# EAGLE design attiny-breakout (EAGLE 9.6.2)
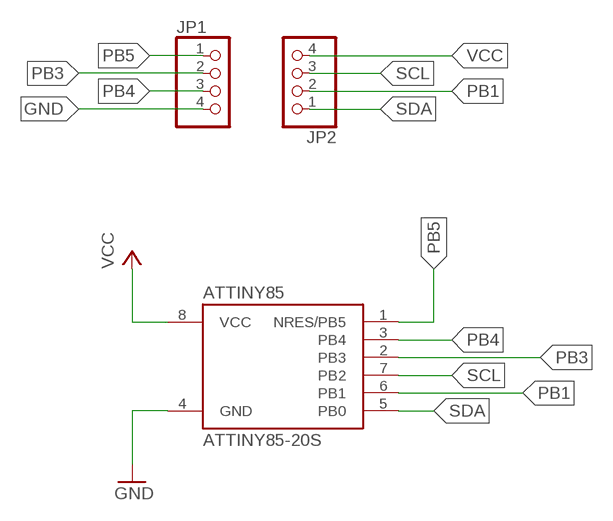
[diagram p0: schematic, sheet 1]

## Parts
ATTINY85  ATTINY85-20S  [SOIC8_EIAJ_208MIL]
JP1  PINHD-1X4  [1X04]
JP2  PINHD-1X4  [1X04]

## Nets
GND: ATTINY85.4(GND) JP1.4
PB1: ATTINY85.6(PB1) JP2.2
PB3: ATTINY85.2(PB3) JP1.2
PB4: ATTINY85.3(PB4) JP1.3
PB5: ATTINY85.1(NRES/PB5) JP1.1
SCL: ATTINY85.7(PB2) JP2.3
SDA: ATTINY85.5(PB0) JP2.1
VCC: ATTINY85.8(VCC) JP2.4

## Library data of the parts
ATTINY85 = _hhn_attiny25_45_85:ATTINY85*: ATMEL ATtiny 85 Packages: P = PDIP 08 30mil S = SOIC 08 EIAJ 208mil Technologies Note: for complete ordering code (temp. range, finish, tape&reel etc.) see www.atmel.com • Supply Voltage: V = (1.8…5.5)V | [blank] = (2.7…5.5)V • Speed: 10 = 10 MHz | 20 = 20 MHz Author: Dipl.-Ing. FH Rainer Bayer HHN Hochschule Heilbronn (Heilbronn University), rainer.bayer@hs-heilbronn.de Ingenieurbüro ing-rb, mail@ing-rb.de
JP1 JP2 = pinhead:PINHD-1X4: PIN HEADER

## Board
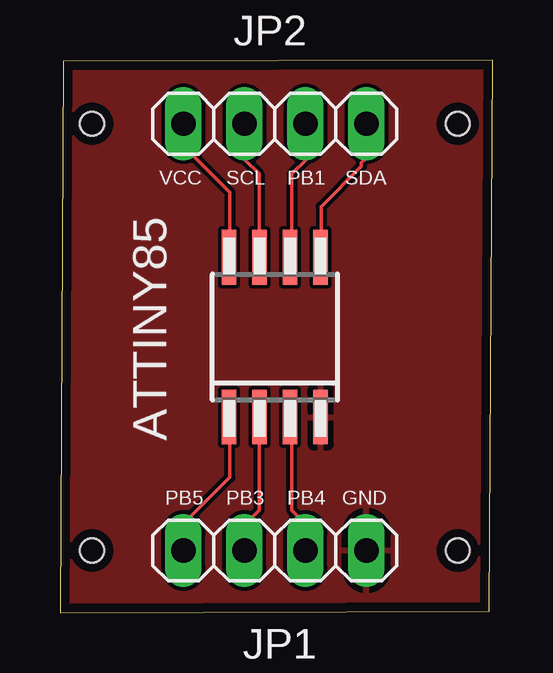
[diagram p1: board, top side]

Size 18.02 x 23.04 mm. Coordinates in mm from the lower left corner, seen from the top.
Outline: 0,0 17.89,0.06 18.02,23.04 0.13,22.98 0,0
Copper layers (1*16): Top 0.035559375mm / dielectric 1.6mm / Bottom 0.035559375mm
Design rules "oshpark-2layer": minimum track width 6mil, minimum drill 10mil, track to track 6mil, track to pad 6mil, pad to pad 6mil, via to via 6mil, smd to smd 6mil, copper to edge 15mil, drill to drill 6mil, minimum pad ring 5mil, minimum via ring 5mil, stop-mask expansion 2.5mil, vias tented up to drill 0mil, thermal gap 10mil
Holes 1 mm at 1.33,20.38 16.57,20.38 1.33,2.6 16.57,2.6

### Footprints (pad centres in the part's own frame; a part is rotated, then mirrored left to right if it is on the bottom)
SOIC8_EIAJ_208MIL = smd 0.6 x 2.286: 1 -1.905,-3.33; 2 -0.635,-3.33; 3 0.635,-3.33; 4 1.905,-3.33; 5 1.905,3.33; 6 0.635,3.33; 7 -0.635,3.33; 8 -1.905,3.33
1X04 = drill 1.016 long: 1 -3.81,0; 2 -1.27,0; 3 1.27,0; 4 3.81,0

### Placement (x,y rotation side)
ATTINY85  8.95,11.49 0 top
JP1  8.95,2.6 0 top
JP2  8.95,20.38 180 top

### Tracks (layer width: path | path; a pad name or v marks a point on that pad's centre or on a via)
GND
  pour Top: -1.21,24.19 -1.21,-1.21 19.11,-1.21 19.11,24.19
PB1
  Top 0.152: ATTINY85.6 9.66,14.94 9.66,18.3 10.27,18.91 10.27,20.28 JP2.2
PB3
  Top 0.152: JP1.2 7.68,3.67 8.29,4.27 8.29,8.08 ATTINY85.2
PB4
  Top 0.152: ATTINY85.3 9.66,8.08 9.66,4.27 10.12,3.82 10.12,2.6 JP1.3
PB5
  Top 0.152: ATTINY85.1 7.07,8.08 7.07,5.65 5.25,3.82 5.25,2.6 JP1.1
SCL
  Top 0.152: JP2.3 7.68,18.91 8.29,18.3 8.29,14.94 ATTINY85.7
SDA
  Top 0.152: ATTINY85.5 10.88,14.94 10.88,16.92 12.56,18.6 12.56,18.75 12.71,18.91 12.71,20.28 JP2.1
VCC
  Top 0.152: ATTINY85.8 7.07,14.94 7.07,17.53 5.25,19.36 5.25,20.28 JP2.4

### Text on the board
tNames: VCC | SCL | PB1 | SDA | PB5 | PB3 | PB4 | GND